# Altium project bt6.PrjPcb
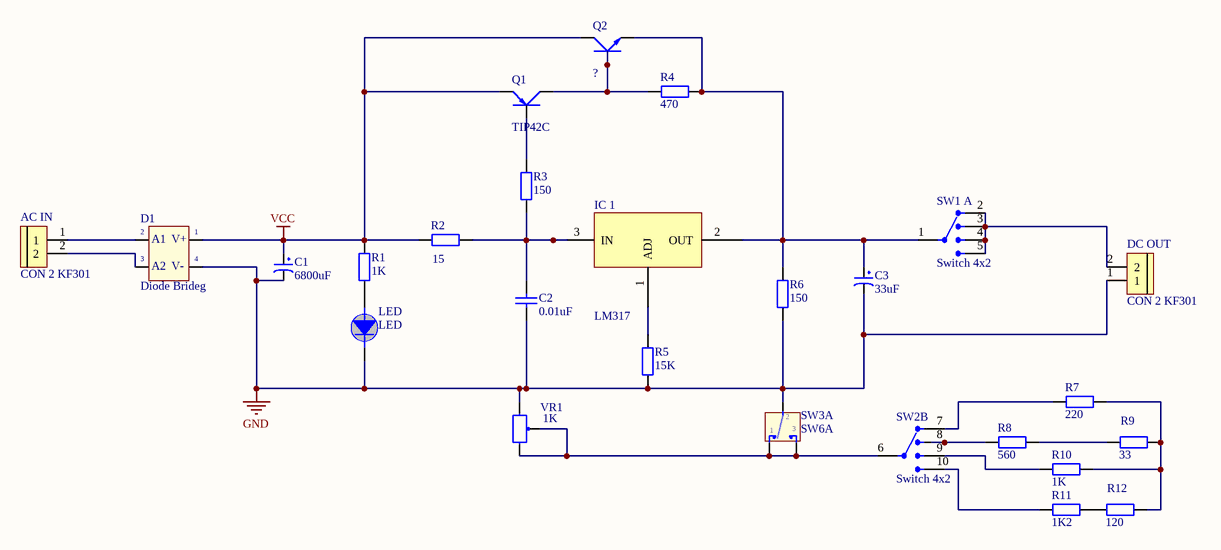
[diagram p0: schematic.SchDoc]
1 sheet, 26 parts. Net scope: global (net labels, ports and power ports of the same name join across sheets).
Board file: PCB.PcbDoc

## Sheet schematic.SchDoc
size A4; SheetNumber: 1; SheetTotal: 1

### Parts
AC_IN  CON 2 KF301  [Con 2 KF301 5.08]
C1  6800uF  [tu hoa 10mm]
C2  0.01uF  [tu gom]
C3  33uF  [tu hoa 10mm]
D1  Diode Brideg  [DIO-Bri 5A]
DC_OUT  CON 2 KF301  [Con 2 KF301 5.08]
IC_1  LM317  [TO220H1]
LED  LED  [LED_phi 5]
Q1  TIP42C  [QTO-220]
Q2  ?  [TO92]
R1  1K  [tro cong suat 5w]
R2  15  [tro cong suat 5w]
R3  150  [tro cong suat 5w]
R4  470  [tro cong suat 5w]
R5  15K  [tro cong suat 5w]
R6  150  [tro cong suat 5w]
R7  220  [tro cong suat 5w]
R8  560  [tro cong suat 5w]
R9  33  [tro cong suat 5w]
R10  1K  [tro cong suat 5w]
R11  1K2  [tro cong suat 5w]
R12  120  [tro cong suat 5w]
SW1  Switch 4x2  [SW4X2]  (part A of 2)
SW2  Switch 4x2  [SW4X2]  (part B of 2)
SW3  SW6A  [SW6]  (part A of 2)
VR1  1K  [Bien Tro Vi Chinh Dung]

### Nets
GND: C1.2 C2.2 C3.2 D1.4(-V_OUT) DC_OUT.1 LED.2(Katot) R5.1 R6.1 SW3.2 VR1.1
VCC: C1.1 D1.1(+V_OUT) Q1.3(E) Q2.3(C) R1.2 R2.1
NetAC_IN_1: AC_IN.1 D1.2(AC1)
NetAC_IN_2: AC_IN.2 D1.3(AC2)
NetC2_1: C2.1 IC_1.3(IN) R2.2 R3.1
NetC3_1: C3.1 IC_1.2(OUT) Q2.1(E) R4.2 R6.2 SW1.1(Com)
NetDC_OUT_2: DC_OUT.2 SW1.2(I/O1) SW1.3(I/O2) SW1.4(I/O3) SW1.5(I/O4)
NetIC_1_1: IC_1.1(ADJ) R5.2
NetLED_1: LED.1(anot) R1.1
NetQ1_1: Q1.1(B) R3.2
NetQ1_2: Q1.2(C) Q2.2(B) R4.1
NetR7_1: R7.1 SW2.7(Com2)
NetR7_2: R7.2 R9.2 R10.2 R12.2
NetR8_1: R8.1 SW2.8(I/O6)
NetR8_2: R8.2 R9.1
NetR10_1: R10.1 SW2.9(I/O7)
NetR11_1: R11.1 SW2.10(I/O8)
NetR11_2: R11.2 R12.1
NetSW2_6: SW2.6(I/O9) SW3.1 SW3.3 VR1.2 VR1.3

### Notes on the sheet
- (in symbol DIODE BRIGDE) A1; V+; A2; V-

### Library data of the parts
AC_IN DC_OUT = CON 2 KF301: Cắm; Ma_Hang: MH000987; Ten_Linh_Kien: CON 2 KF301-2P 5.08MM Xanh Dương; Chung_Loai: Cắm; Ghi_Chu: *; Kieu_Chan: *; Don_Vi: Con
C1 C3 = Tu Hoa 220uF 50V 10x14: Cắm; Don_Vi: Con; So_Chan: 2; Ten_Linh_Kien: Tụ Hóa 220uF 50V; Ma_Hang: MH006873; Chung_Loai: Cắm; Kieu_Chan: *
C2 = Tu gom 104 50V: Cắm; So_Chan: 2; Ten_Linh_Kien: Tụ gốm 104 100nF 50V; Don_Vi: Con; Ma_Hang: MH004761; Chung_Loai: Cắm; Kieu_Chan: *
D1 = DIODE BRIGDE: Convert AC to DC voltage, 4 pin; Value: Cau 1A
IC_1 = LM317 TO220: Cắm; Ten_Linh_Kien: LM317T TO220 REG LDO ADJ 1.5A; Ma_Hang: MH003115; Don_Vi: Con; Kieu_Chan: *; Ghi_Chu: *; Chung_Loai: Cắm
LED = LED_phi 5
Q1 = TIP42C: PNP 2W, BCE; Value: TIP42C
Q2 = Trans 2N3904: NPN transistor EBC; Value: C9014
R1-R12 = Tro Cong Suat 5W 5% 0.05R: Cắm; Don_Vi: Con; So_Chan: 2; Ten_Linh_Kien: Trở Sứ 5w 5% 0.05R; Ma_Hang: MH001093; Chung_Loai: Cắm; Kieu_Chan: *
SW1 SW2 = SW4x2: Value: Switch 4x2
SW3 = SW6A: SW-DTDP - 6 Pin; Value: SW6
VR1 = Bien Tro Tinh Chinh 1K Dung: Cắm; Don_Vi: Con; Ten_Linh_Kien: Biến Trở VR 102-1K 3296W; Ma_Hang: MH003234; Kieu_Chan: *; Chung_Loai: Cắm